# EAGLE schematic main (EAGLE 9.2.2)
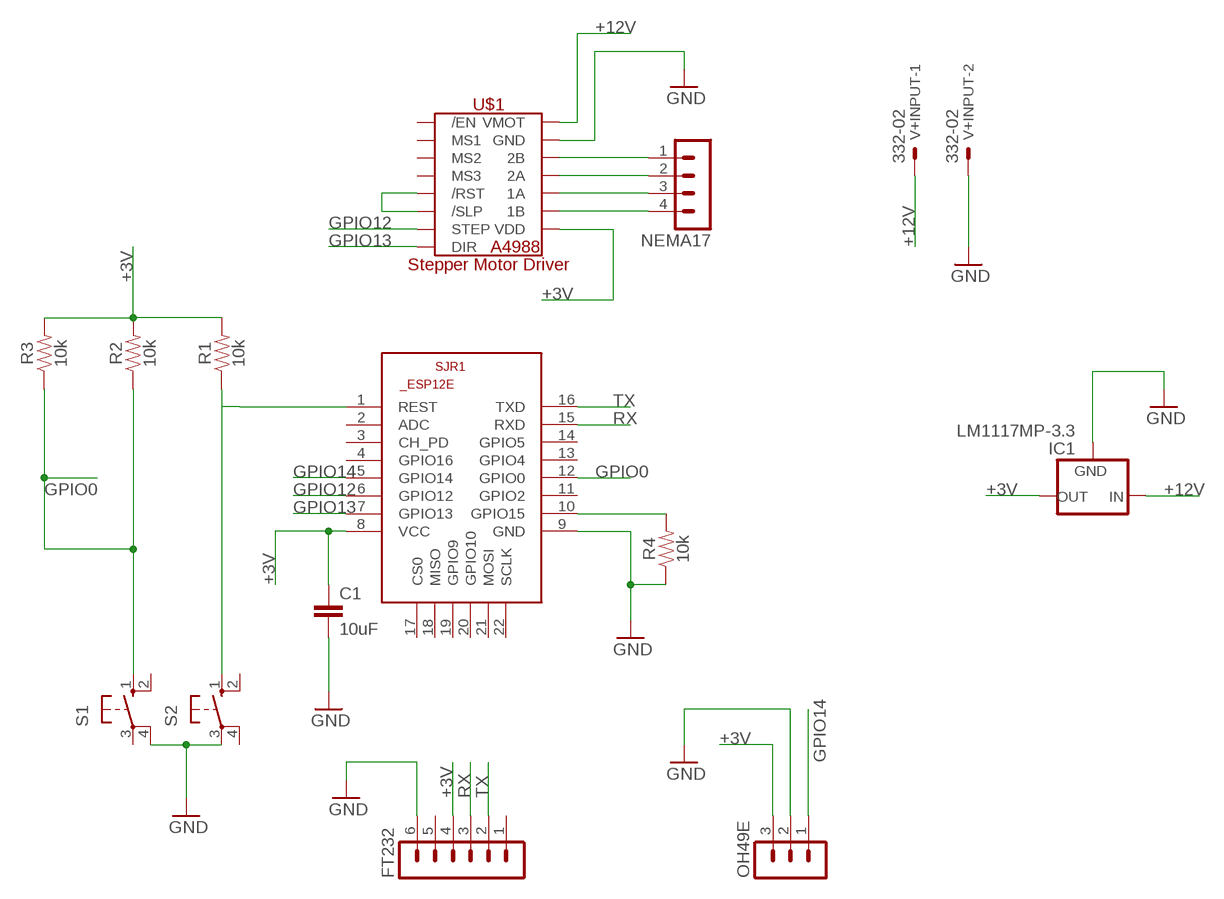
[diagram p0: schematic, sheet 1]

## Parts
C1  10uF  CC1206  [C1206]
FT232  MA06-1  [MA06-1]
IC1  LM1117MP-3.3  [SOT223]
NEMA17  MA04-1  [MA04-1]
OH49E  MA03-1  [MA03-1]
R1  10k  10KOHM-0603-1/10W-1%  [0603]
R2  10k  10KOHM-0603-1/10W-1%  [0603]
R3  10k  10KOHM-0603-1/10W-1%  [0603]
R4  10k  10KOHM-0603-1/10W-1%  [0603]
S1  10-XX  [B3F-10XX]
S2  10-XX  [B3F-10XX]
SJR1  ESP8266-12EESP12E  [ESP8266-ESP12E]
U$1  A4988_STEP  [A4988_STEP]
V+INPUT  332-02  [332-02]

## Nets
+3V: C1.1 FT232.4 IC1.2(OUT) IC1.4(OUT) OH49E.3 R1.2 R2.2 R3.2 SJR1.8(VCC) U$1.VDD
+12V: IC1.3(IN) U$1.VMOT V+INPUT.1
GND: C1.2 FT232.6 IC1.1(GND) OH49E.2 R4.1 S1.4(P1) S2.3(P) SJR1.9(GND) U$1.GND U$1.GND2(GND) V+INPUT.2
GPIO0: R2.1 R3.1 S1.1(S) SJR1.12(GPIO0)
GPIO12: SJR1.6(GPIO12) U$1.STEP
GPIO13: SJR1.7(GPIO13) U$1.DIR
GPIO14: OH49E.1 SJR1.5(GPIO14)
N$1: R1.1 S2.1(S) SJR1.1(REST)
N$3: R4.2 SJR1.10(GPIO15)
N$4: NEMA17.4 U$1.1B
N$5: NEMA17.3 U$1.1A
N$6: NEMA17.2 U$1.2A
N$7: NEMA17.1 U$1.2B
N$8: U$1./RST U$1./SLP
RX: FT232.3 SJR1.15(RXD)
TX: FT232.2 SJR1.16(TXD)
Unconnected: FT232.1 FT232.5 S1.2(S1) S1.3(P) S2.2(S1) S2.4(P1) SJR1.2(ADC) SJR1.3(CH_PD) SJR1.4(GPIO16) SJR1.11(GPIO2) SJR1.13(GPIO4) SJR1.14(GPIO5) SJR1.17(CS0) SJR1.18(MISO) SJR1.19(GPIO9) SJR1.20(GPIO10) SJR1.21(MOSI) SJR1.22(SCLK) U$1./EN U$1.MS1 U$1.MS2 U$1.MS3

## Library data of the parts
C1 = eagle-ltspice:C: CAPACITOR, European symbol; SPICEMODEL: NONE; SPICEPREFIX: C
FT232 = con-lstb:MA06-1: PIN HEADER; OC_FARNELL: unknown; OC_NEWARK: unknown
IC1 = lm1117_10:LM1117?-*: 800mA Low-Dropout Linear Regulator Source: http://www.ti.com/lit/ds/symlink/lm1117-n.pdf; MF: Texas Instruments; MPN: LM1117MP-3.3; OC_FARNELL: 9778195; OC_NEWARK: 28X3416
NEMA17 = con-lstb:MA04-1: PIN HEADER; OC_FARNELL: unknown; OC_NEWARK: unknown
OH49E = con-lstb:MA03-1: PIN HEADER; OC_FARNELL: unknown; OC_NEWARK: unknown
R1-R4 = SparkFun-Resistors:10KOHM: 10kΩ resistor A resistor is a passive two-terminal electrical component that implements electrical resistance as a circuit element. Resistors act to reduce current flow, and, at the same time, act to lower voltage levels within circuits. - Wikipedia; PROD_ID: RES-00824
S1 S2 = switch-omron:10-XX: OMRON SWITCH; MPN: B3F-1000; OC_FARNELL: 176432; OC_NEWARK: 36M3542
SJR1 = esp12e:ESP8266-12E: ESP8266-12E Library for Eagle CAD The author not responsible for any damages or errors!. Created by Suhail jr.lt;/author>
U$1 = IC:A4988_STEP
V+INPUT = con-garry:332-02: 2 Pin - 2mm Dual Row Source: www.mpe-connector.de / garry_shortform_2012.pdf